# EAGLE design UnderWaterMetalDetector_v2 (EAGLE 6.5.0)

## Sheet 1 of 4
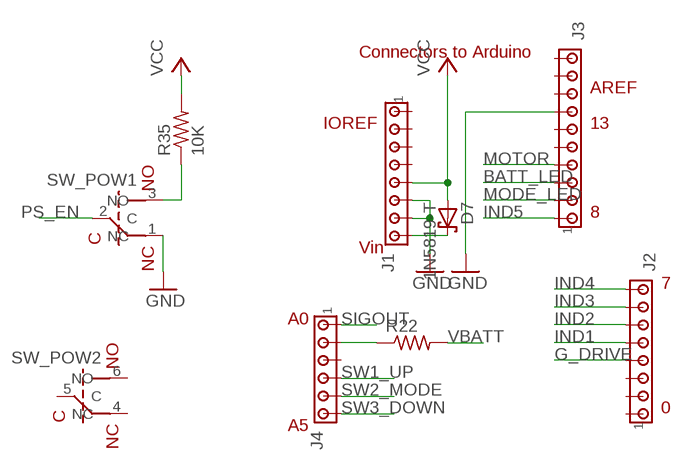
[diagram p0: schematic, sheet 1]

### Parts
D7  1N5819-T  [DO41-7.6]
J1  MTA08-100  [10X08MTA]
J2  MTA08-100  [10X08MTA]
J3  MTA10-100  [10X10MTA]
J4  MTA06-100  [10X06MTA]
R22  R-US_R1206  [R1206]
R35  10K  R-US_R1206  [R1206]
SW_POW  SW-TL2201EEYA  [SW-TL2201EEYA]

### Nets
BATT_LED: J3.3 ; also sheet 2
G_DRIVE: J2.4 ; also sheet 3
GND: J1.6 J1.7 J3.7 SW_POW.1(1:NC) ; also sheet 2,3,4
IND1: J2.5 ; also sheet 2
IND2: J2.6 ; also sheet 2
IND3: J2.7 ; also sheet 2
IND4: J2.8 ; also sheet 2
IND5: J3.1 ; also sheet 2
MODE_LED: J3.2 ; also sheet 2
MOTOR: J3.4 ; also sheet 2
N$14: J4.5 R22.1
N$15: D7.C J1.8
N$52: R35.1 SW_POW.3(1:NO)
PS_EN: SW_POW.2(1:C) ; also sheet 4
SIGOUT: J4.6 ; also sheet 3
SW1_UP: J4.3 ; also sheet 2
SW2_MODE: J4.2 ; also sheet 2
SW3_DOWN: J4.1 ; also sheet 2
VBATT: R22.2 ; also sheet 4
VCC: D7.A J1.5 R35.2 ; also sheet 2,3,4
Unconnected: J1.1 J1.2 J1.3 J1.4 J2.1 J2.2 J2.3 J3.5 J3.6 J3.8 J3.9 J3.10 J4.4 SW_POW.4(2:NC) SW_POW.5(2:C) SW_POW.6(2:NO)

### Notes on the sheet
- Connectors to Arduino
- AREF
- IOREF | 13
- 8
- Vin
- 7
- A0
- 0
- A5

## Sheet 2 of 4: User Interface
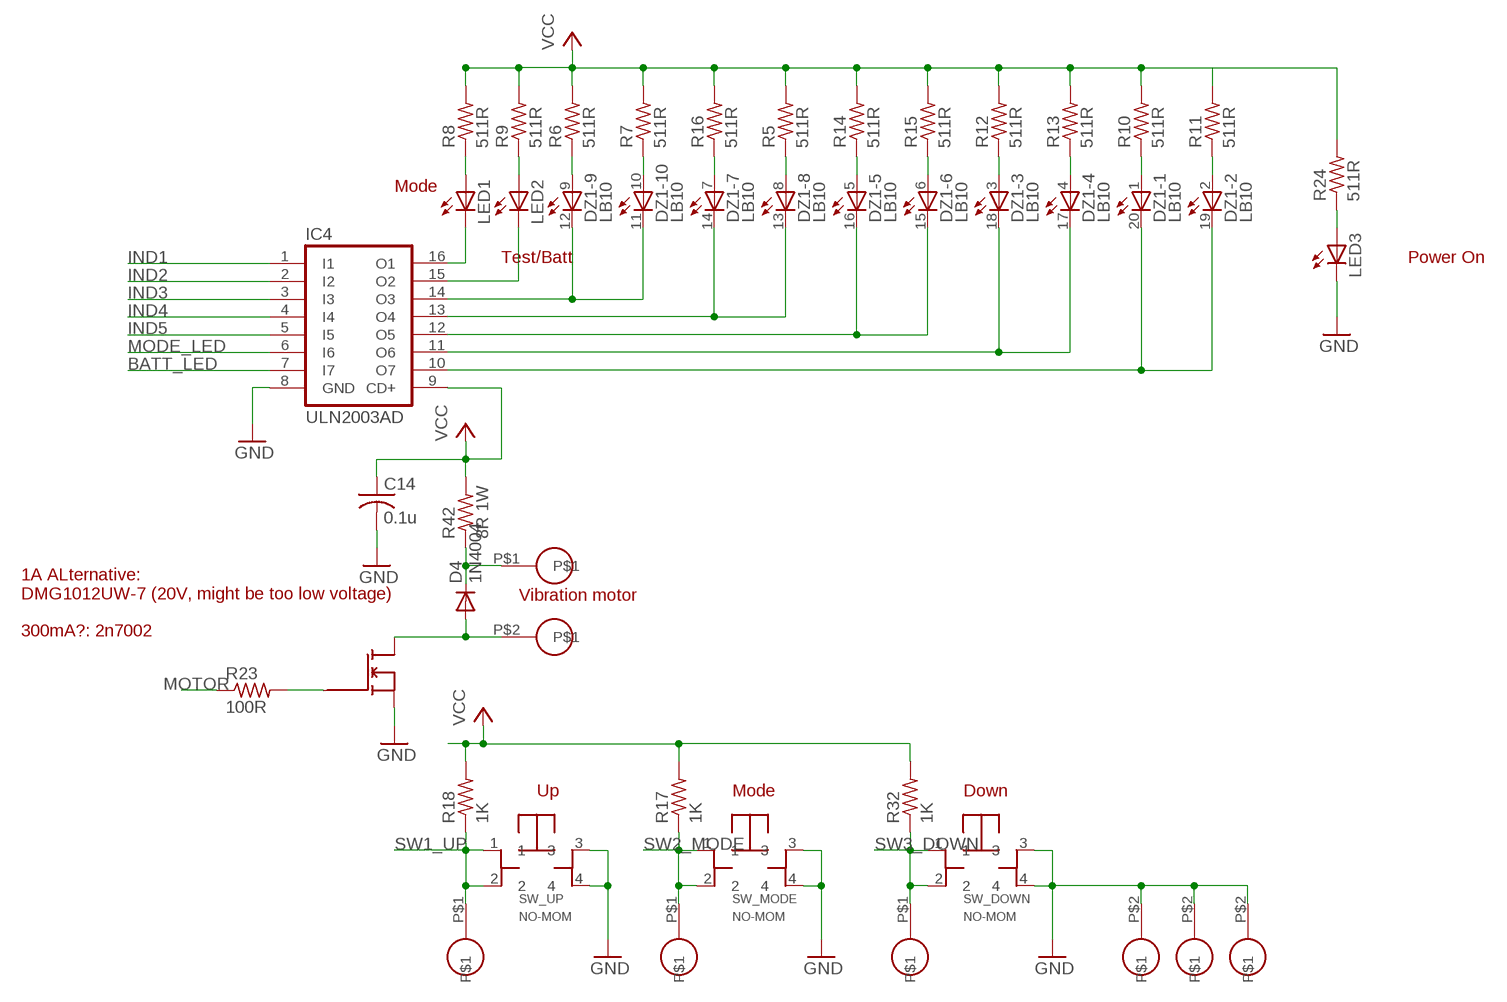
[diagram p1: schematic, sheet 2]

### Parts
C14  0.1u  C-USC1206  [C1206]
D4  1N4004  [DO41-10]
DOWN  CON-SIP2-0.1  [CON-SIP2-0.1]
DZ1  LB10  [LB10]
IC4  ULN2003AD  [SO16]
LED1  LED5MM  [LED5MM]
LED2  LED5MM  [LED5MM]
LED3  LED5MM  [LED5MM]
MODE  CON-SIP2-0.1  [CON-SIP2-0.1]
MOTOR  CON-SIP2-0.1  [CON-SIP2-0.1]
Q2  FET-2N7000  [TO92]
R5  511R  R-US_M1206  [M1206]
R6  511R  R-US_M1206  [M1206]
R7  511R  R-US_M1206  [M1206]
R8  511R  R-US_M1206  [M1206]
R9  511R  R-US_M1206  [M1206]
R10  511R  R-US_M1206  [M1206]
R11  511R  R-US_M1206  [M1206]
R12  511R  R-US_M1206  [M1206]
R13  511R  R-US_M1206  [M1206]
R14  511R  R-US_M1206  [M1206]
R15  511R  R-US_M1206  [M1206]
R16  511R  R-US_M1206  [M1206]
R17  1K  R-US_M1206  [M1206]
R18  1K  R-US_M1206  [M1206]
R23  100R  R-US_R1206  [R1206]
R24  511R  R-US_M1206  [M1206]
R32  1K  R-US_M1206  [M1206]
R42  8R 1W  R-US_R2512  [R2512]
SW_DOWN  SW-SCHURTER-1301.9306  [SW-SCHURTER-1301.9306]
SW_MODE  SW-SCHURTER-1301.9306  [SW-SCHURTER-1301.9306]
SW_UP  SW-SCHURTER-1301.9306  [SW-SCHURTER-1301.9306]
UP  CON-SIP2-0.1  [CON-SIP2-0.1]

### Nets
BATT_LED: IC4.7(I7) ; also sheet 1
GND: C14.2 DOWN.P$2 IC4.8(GND) LED3.K(C) MODE.P$2 Q2.1(S) SW_DOWN.3 SW_DOWN.4 SW_MODE.3 SW_MODE.4 SW_UP.3 SW_UP.4 UP.P$2 ; also sheet 1,3,4
IND1: IC4.1(I1) ; also sheet 1
IND2: IC4.2(I2) ; also sheet 1
IND3: IC4.3(I3) ; also sheet 1
IND4: IC4.4(I4) ; also sheet 1
IND5: IC4.5(I5) ; also sheet 1
MODE_LED: IC4.6(I6) ; also sheet 1
MOTOR: R23.1 ; also sheet 1
N$11 [Power]: D4.C MOTOR.P$1 R42.1
N$12: DZ1.17(-4:C) DZ1.18(-3:C) IC4.11(O6)
N$16: Q2.2(G) R23.2
N$17: LED3.A R24.1
N$20: DZ1.19(-2:C) DZ1.20(-1:C) IC4.10(O7)
N$22: DZ1.15(-6:C) DZ1.16(-5:C) IC4.12(O5)
N$23: DZ1.13(-8:C) DZ1.14(-7:C) IC4.13(O4)
N$24: DZ1.11(-10:C) DZ1.12(-9:C) IC4.14(O3)
N$25: IC4.16(O1) LED1.K(C)
N$26: IC4.15(O2) LED2.K(C)
N$32: LED2.A R9.1
N$33: LED1.A R8.1
N$34: DZ1.10(-10:A) R7.1
N$35: DZ1.9(-9:A) R6.1
N$36: DZ1.8(-8:A) R5.1
N$37: DZ1.1(-1:A) R10.1
N$38: DZ1.2(-2:A) R11.1
N$39: DZ1.3(-3:A) R12.1
N$40: DZ1.4(-4:A) R13.1
N$41: DZ1.5(-5:A) R14.1
N$42: DZ1.6(-6:A) R15.1
N$43: DZ1.7(-7:A) R16.1
N$46 [Power]: D4.A MOTOR.P$2 Q2.3(D)
SW1_UP: R18.1 SW_UP.1 SW_UP.2 UP.P$1 ; also sheet 1
SW2_MODE: MODE.P$1 R17.1 SW_MODE.1 SW_MODE.2 ; also sheet 1
SW3_DOWN: DOWN.P$1 R32.1 SW_DOWN.1 SW_DOWN.2 ; also sheet 1
VCC: C14.1 IC4.9(CD+) R5.2 R6.2 R7.2 R8.2 R9.2 R10.2 R11.2 R12.2 R13.2 R14.2 R15.2 R16.2 R17.2 R18.2 R24.2 R32.2 R42.2 ; also sheet 1,3,4

### Notes on the sheet
- Mode
- Test/Batt | Power On
- Vibration motor
- 1A ALternative:
  DMG1012UW-7 (20V, might be too low voltage)
  
  300mA?: 2n7002
- Up | Mode | Down

## Sheet 3 of 4
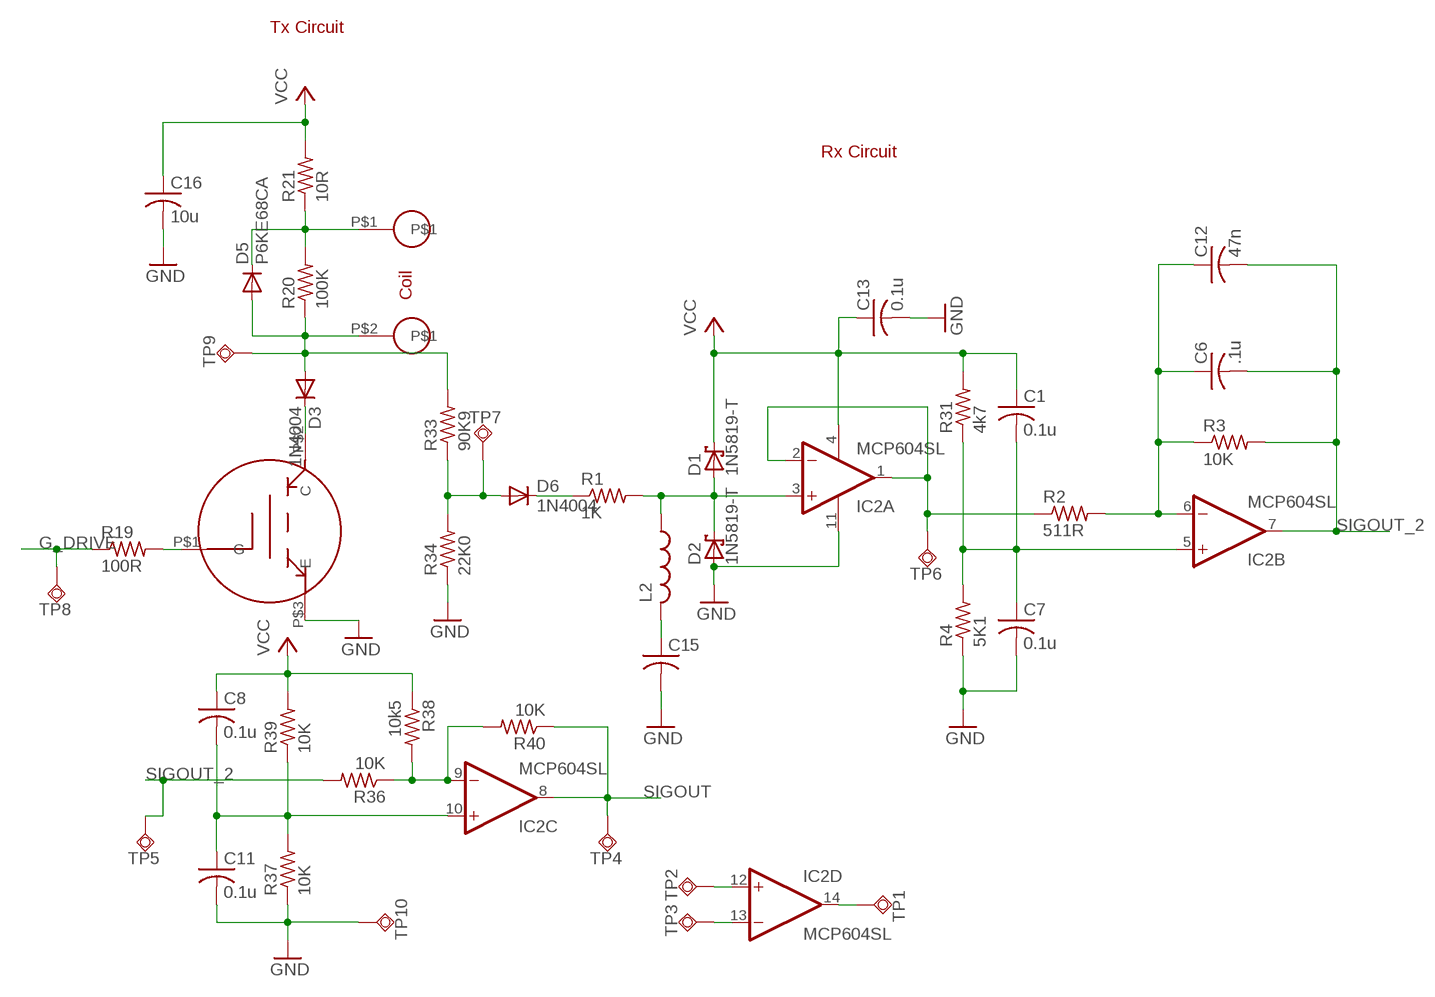
[diagram p2: schematic, sheet 3]

### Parts
C1  0.1u  C-USC1206  [C1206]
C6  .1u  C-USC1206  [C1206]
C7  0.1u  C-USC1206  [C1206]
C8  0.1u  C-USC1206  [C1206]
C11  0.1u  C-USC1206  [C1206]
C12  47n  C-USC1206  [C1206]
C13  0.1u  C-USC1206  [C1206]
C15  C-USC1206  [C1206]
C16  10u  C-USC1206  [C1206]
COIL  CON-SIP2-0.1  [CON-SIP2-0.1]
D1  1N5819-T  [DO41-7.6]
D2  1N5819-T  [DO41-7.6]
D3  1N4004  [DO41-10]
D5  P6KE68CA  DIODE-D-5  [D-5]
D6  1N4004  [DO41-10]
IC2  MCP604SL  [SO14]
L2  L-US0204V  [0204V]
Q1  STGP18N40LZ  [TO-220-HORIZ]
R1  1K  R-US_M1206  [M1206]
R2  511R  R-US_R1206  [R1206]
R3  10K  R-US_R1206  [R1206]
R4  5K1  R-US_R1206  [R1206]
R19  100R  R-US_R1206  [R1206]
R20  100K  R-US_M1206  [M1206]
R21  10R  R-US_R2512  [R2512]
R31  4k7  R-US_R1206  [R1206]
R33  90K9  R-US_M1206  [M1206]
R34  22K0  R-US_M1206  [M1206]
R36  10K  R-US_M1206  [M1206]
R37  10K  R-US_M1206  [M1206]
R38  10k5  R-US_M1206  [M1206]
R39  10K  R-US_M1206  [M1206]
R40  10K  R-US_M1206  [M1206]
TP1  TPSQPAD1-13  [P1-13]
TP2  TPSQPAD1-13  [P1-13]
TP3  TPSQPAD1-13  [P1-13]
TP4  TPSQPAD1-13  [P1-13]
TP5  TPSQPAD1-13  [P1-13]
TP6  TPSQPAD1-13  [P1-13]
TP7  TPSQPAD1-13  [P1-13]
TP8  TPSQPAD1-13  [P1-13]
TP9  TPSQPAD1-13  [P1-13]
TP10  TPSQPAD1-13  [P1-13]

### Nets
G_DRIVE: R19.1 TP8.TP ; also sheet 1
GND: C7.2 C11.2 C13.2 C15.2 C16.2 D2.A IC2.11(P:V-) Q1.P$3(E) R4.1 R34.1 R37.1 TP10.TP ; also sheet 1,2,4
N$1: IC2.1(A:OUT) IC2.2(A:-IN) R2.1 TP6.TP
N$2: D1.A D2.C IC2.3(A:+IN) L2.1 R1.2
N$3: D6.C R1.1
N$4: C1.2 C7.1 IC2.5(B:+IN) R4.2 R31.1
N$5: C8.2 C11.1 IC2.10(C:+IN) R37.2 R39.1
N$6: D6.A R33.1 R34.2 TP7.TP
N$7: C6.1 C12.1 IC2.6(B:-IN) R2.2 R3.1
N$8: IC2.9(C:-IN) R36.1 R38.2 R40.2
N$9: IC2.12(D:+IN) TP2.TP
N$10: IC2.13(D:-IN) TP3.TP
N$13: IC2.14(D:OUT) TP1.TP
N$27: C15.1 L2.2
N$44 [Power]: COIL.P$1 D5.C R20.2 R21.1
N$47 [Power]: D3.C Q1.P$2(C)
N$48: Q1.P$1(G) R19.2
RXIN [Power]: COIL.P$2 D3.A D5.A R20.1 R33.2 TP9.TP
SIGOUT: IC2.8(C:OUT) R40.1 TP4.TP ; also sheet 1
SIGOUT_2: C6.2 C12.2 IC2.7(B:OUT) R3.2 R36.2 TP5.TP
VCC: C1.1 C8.1 C13.1 C16.1 D1.C IC2.4(P:V+) R21.2 R31.2 R38.1 R39.2 ; also sheet 1,2,4

### Notes on the sheet
- Tx Circuit
- Rx Circuit
- Coil

## Sheet 4 of 4
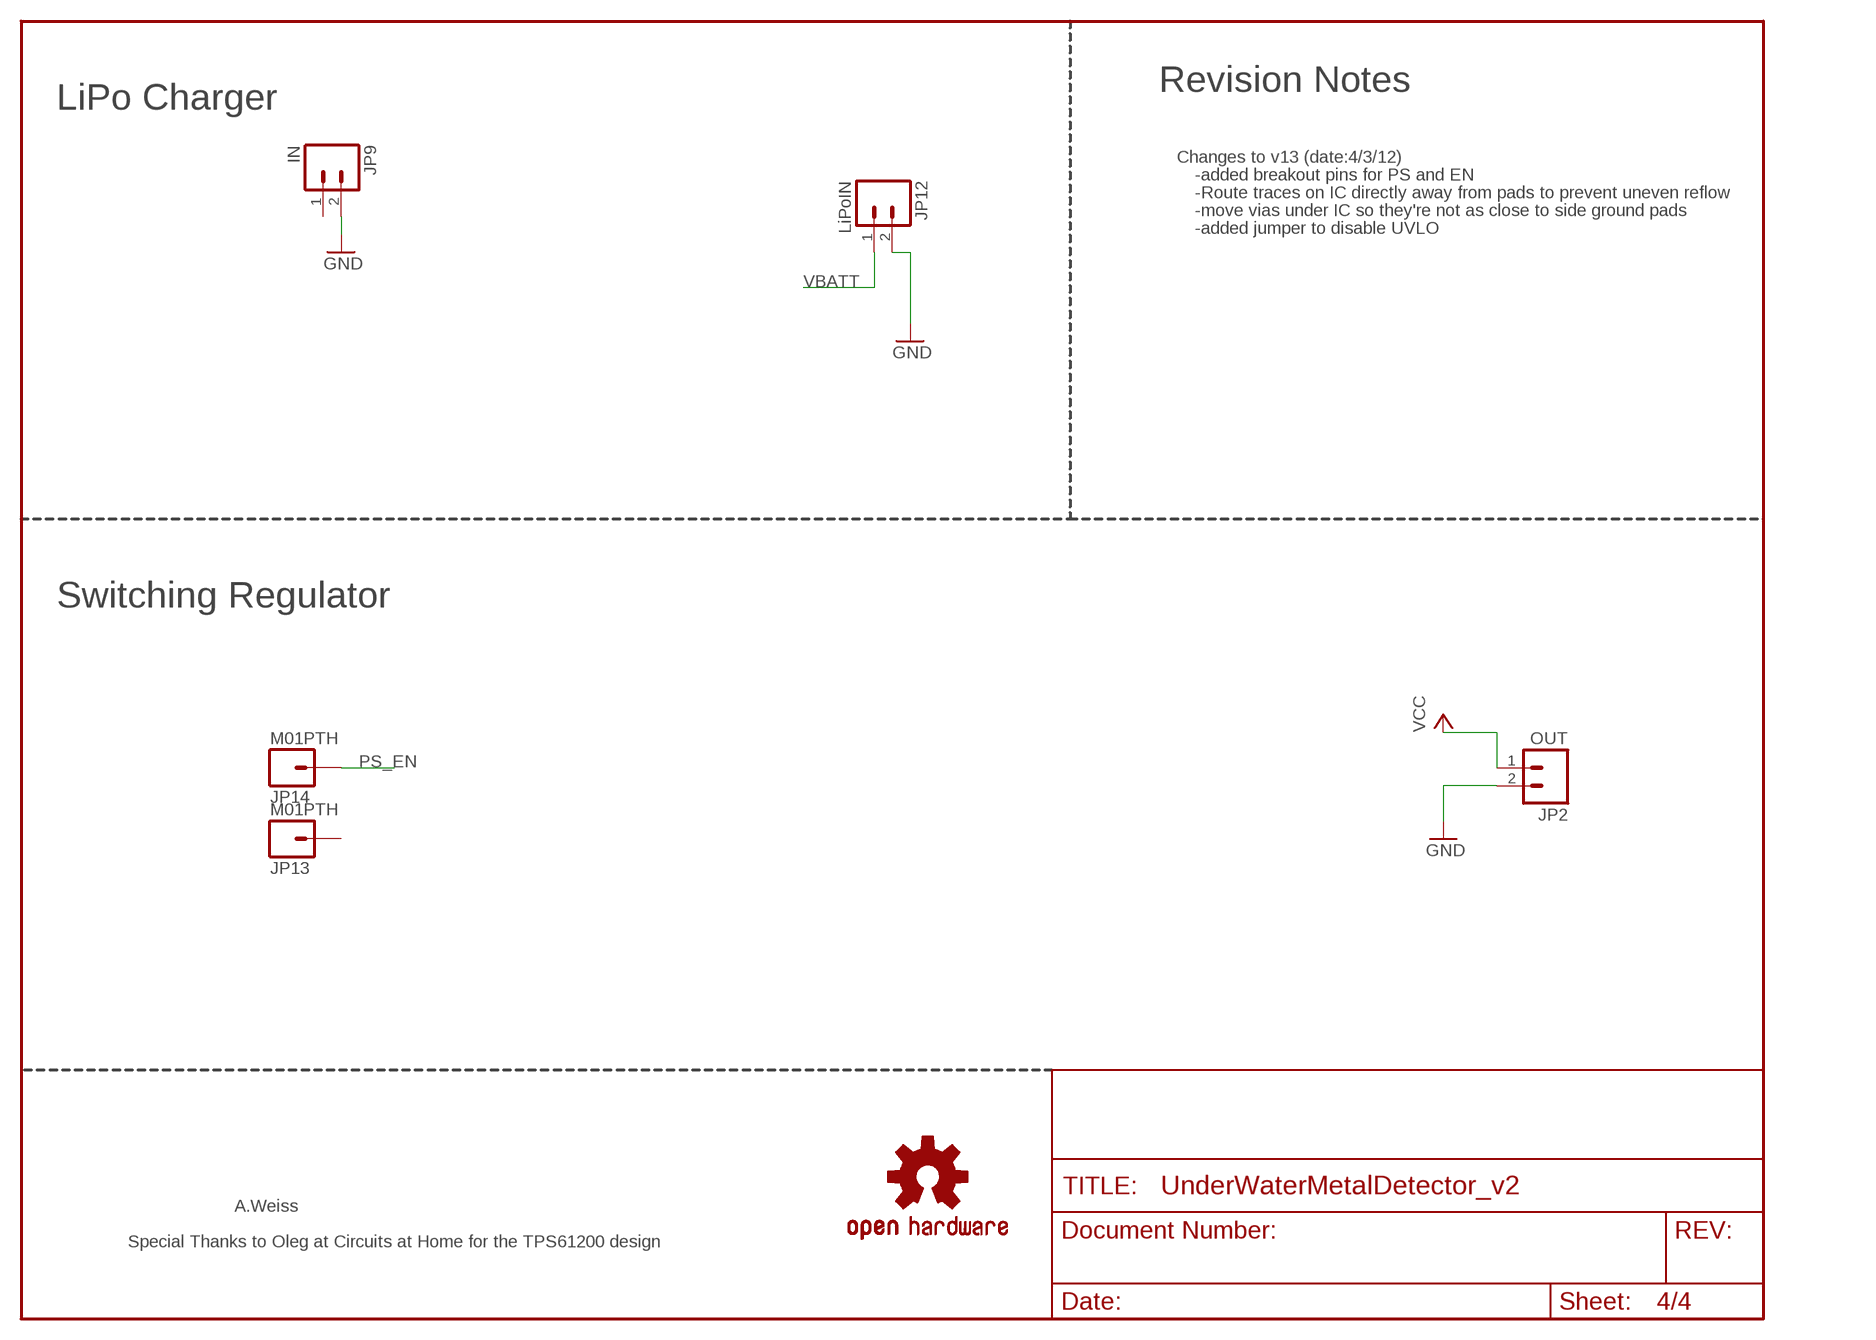
[diagram p3: schematic, sheet 4]

### Parts
JP2  OUT  M02PTH  [1X02]
JP9  IN  M02PTH  [1X02]
JP12  LiPoIN  M02PTH  [1X02]
JP13  M01PTH  [1X01]
JP14  M01PTH  [1X01]
U$3  OSHW-LOGOS  [OSHW-LOGO-S]

### Nets
GND: JP2.2 JP9.2 JP12.2 ; also sheet 1,2,3
PS_EN: JP14.1 ; also sheet 1
VBATT: JP12.1 ; also sheet 1
VCC: JP2.1 ; also sheet 1,2,3
Unconnected: JP9.1 JP13.1

### Notes on the sheet
- Revision Notes
- LiPo Charger
- Changes to v13 (date:4/3/12)
- -added breakout pins for PS and EN
- -Route traces on IC directly away from pads to prevent uneven reflow
- -move vias under IC so they're not as close to side ground pads
- -added jumper to disable UVLO
- Switching Regulator
- A.Weiss
- Special Thanks to Oleg at Circuits at Home for the TPS61200 design

## Library data of the parts
C1 C6-C8 C11-C16 = rcl:C-US: CAPACITOR, American symbol
COIL DOWN MODE MOTOR UP = PersonalLib-CRM:CON-SIP2-0.1
D1 D2 D7 = diode:1N581*: 1.0A SCHOTTKY BARRIER RECTIFIER Source: http://www.diodes.com/datasheets/ds23001.pdf
D3 D4 D6 = diode:1N4004: DIODE general purpose rectifier, 1 A
D5 = diode:DIODE-: DIODE
DZ1 = led:LB10: LED BLOCK 10-LED bar graph, DIL, Siemens
IC2 = linear:MCP604: Quad Op Amp 2.7V to 6.0V Single Supply CMOS Source: http://ww1.microchip.com/downloads/en/DeviceDoc/21314g.pdf
IC4 = uln-udn:ULN2003A: DRIVER ARRAY
J1 J2 = con-amp:MTA08-100: AMP connector
J3 = con-amp:MTA10-100: AMP connector
J4 = con-amp:MTA06-100: AMP connector
JP2 JP9 JP12 = SparkFun:M02: Header 2 Standard 2-pin 0.1" header. Use with straight break away headers (SKU : PRT-00116), right angle break away headers (PRT-00553), swiss pins (PRT-00743), machine pins (PRT-00117), and female headers (PRT-00115). Molex polarized connector foot print use with SKU : PRT-08233 with associated crimp pins and housings.
JP13 JP14 = SparkFun:M01: Header 1 Standard 1-pin 0.1" header. Use with straight break away headers (SKU : PRT-00116), right angle break away headers (PRT-00553), swiss pins (PRT-00743), machine pins (PRT-00117), and female headers (PRT-00115).
L2 = rcl:L-US: INDUCTOR, American symbol
LED1-LED3 = led:LED: LED OSRAM: - CHIPLED LG R971, LG N971, LY N971, LG Q971, LY Q971, LO R971, LY R971 LH N974, LH R974 LS Q976, LO Q976, LY Q976 LO Q996 - Hyper CHIPLED LW Q18S LB Q993, LB Q99A, LB R99A - SideLED LS A670, LO A670, LY A670, LG A670, LP A670 LB A673, LV A673, LT A673, LW A673 LH A674 LY A675 LS A676, LA A676, LO A676, LY A676, LW A676 LS A679, LY A679, LG A679 - Hyper Micro SIDELED® LS Y876, LA Y876, LO Y876, LY Y876 LT Y87S - SmartLED LW L88C, LW L88S LB L89C, LB L89S, LG L890 LS L89K, LO L89K, LY L89K LS L896, LA L896, LO L896, LY L896 - TOPLED LS T670, LO T670, LY T670, LG T670, LP T670 LSG T670, LSP T670, LSY T670, LOP T670, LYG T670 LG T671, LOG T671, LSG T671 LB T673, LV T673, LT T673, LW T673 LH T674 LS T676, LA T676, LO T676, LY T676, LB T676, LH T676, LSB T676, LW T676 LB T67C, LV T67C, LT T67C, LS T67K, LO T67K, LY T67K, LW E67C LS E67B, LA E67B, LO E67B, LY E67B, LB E67C, LV E67C, LT E67C LW T67C LS T679, LY T679, LG T679 LS T770, LO T770, LY T770, LG T770, LP T770 LB T773, LV T773, LT T773, LW T773 LH T774 LS E675, LA E675, LY E675, LS T675 LS T776, LA T776, LO T776, LY T776, LB T776 LHGB T686 LT T68C, LB T68C - Hyper Mini TOPLED® LB M676 - Mini TOPLED Santana® LG M470 LS M47K, LO M47K, LY M47K Source: http://www.osram.convergy.de LUXEON: - LUMILED® LXK2-PW12-R00, LXK2-PW12-S00, LXK2-PW14-U00, LXK2-PW14-V00 LXK2-PM12-R00, LXK2-PM12-S00, LXK2-PM14-U00 LXK2-PE12-Q00, LXK2-PE12-R00, LXK2-PE12-S00, LXK2-PE14-T00, LXK2-PE14-U00 LXK2-PB12-K00, LXK2-PB12-L00, LXK2-PB12-M00, LXK2-PB14-N00, LXK2-PB14-P00, LXK2-PB14-Q00 LXK2-PR12-L00, LXK2-PR12-M00, LXK2-PR14-Q00, LXK2-PR14-R00 LXK2-PD12-Q00, LXK2-PD12-R00, LXK2-PD12-S00 LXK2-PH12-R00, LXK2-PH12-S00 LXK2-PL12-P00, LXK2-PL12-Q00, LXK2-PL12-R00 Source: www.luxeon.com KINGBRIGHT: KA-3528ASYC Source: www.kingbright.com
Q1 = PersonalLib-CRM:STGP18N40LZ
Q2 = PersonalLib-CRM:FET-2N7000
R1-R24 R31-R40 R42 = rcl:R-US_: RESISTOR, American symbol
SW_DOWN SW_MODE SW_UP = ClickTracker:SW-SCHURTER-1301.9306
SW_POW = PersonalLib-CRM:SW-TL2201EEYA
TP1-TP10 = testpad:TPSQ: Test pad
U$3 = SparkFun:OSHW-LOGO: Open Source Hardware Logo This logo indicates the piece of hardware it is found on incorporates a OSHW license and/or adheres to the definition of open source hardware found here: http://freedomdefined.org/OSHW

## Net classes
0 default: width 0.254 mm
1 Power: width 0.635 mm

## Board
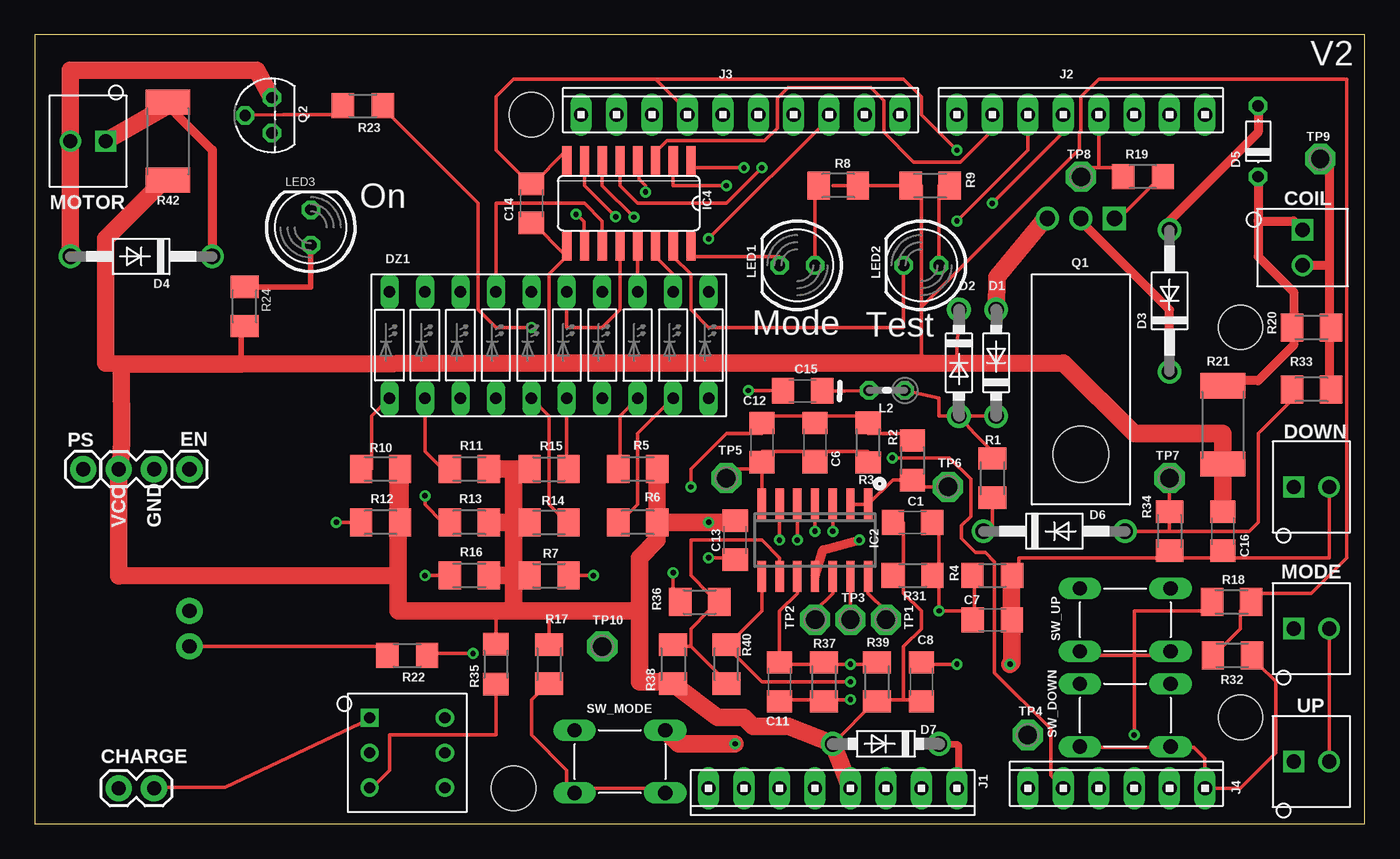
[diagram p4: board, top side]
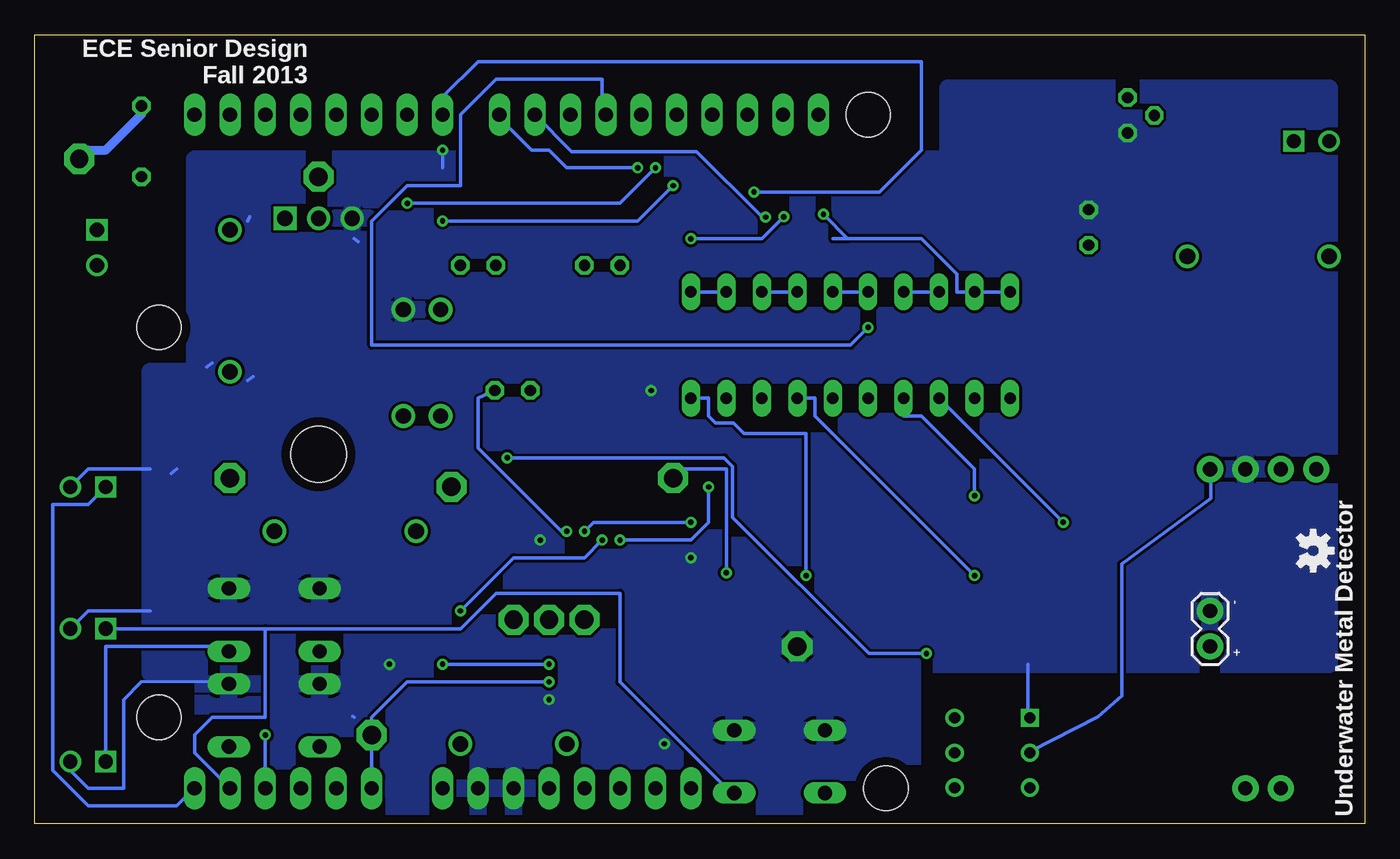
[diagram p5: board, bottom side, seen from below]

Size 95.25 x 56.52 mm. Coordinates in mm from the lower left corner, seen from the top.
Outline: 0,0 95.25,0 95.25,56.52 0,56.52 0,0
Copper layers (1*16): Top 0.035mm / dielectric 1.5mm / Bottom 0.035mm
Design rules "default": minimum track width 6mil, minimum drill 15mil, track to track 8mil, track to pad 8mil, pad to pad 8mil, via to via 8mil, smd to smd 8mil, copper to edge 25mil, drill to drill 8mil, minimum pad ring 10mil, minimum via ring 8mil, stop-mask expansion 4mil, vias tented up to drill 0mil, thermal gap 10mil
Holes 3.17 mm at 86.36,7.62 35.56,50.8 86.36,35.56 34.29,2.54

### Footprints (pad centres in the part's own frame; a part is rotated, then mirrored left to right if it is on the bottom)
C1206 = smd 1.6 x 1.8: 1 -1.4,0; 2 1.4,0
CON-SIP2-0.1 = drill 1.016 square: P$1 -1.27,0 | drill 1.016: P$2 1.27,0
DO41-7.6 = drill 1.1 pad 1.7: A 3.81,0; C -3.81,0
DO41-10 = drill 1.118: A 5.08,0; C -5.08,0
D-5 = drill 0.813 octagon: A 2.54,0; C -2.54,0
LB10 = drill 0.813 long: 1 -11.43,-3.81; 2 -8.89,-3.81; 3 -6.35,-3.81; 4 -3.81,-3.81; 5 -1.27,-3.81; 6 1.27,-3.81; 7 3.81,-3.81; 8 6.35,-3.81; 9 8.89,-3.81; 10 11.43,-3.81; 11 11.43,3.81; 12 8.89,3.81; 13 6.35,3.81; 14 3.81,3.81; 15 1.27,3.81; 16 -1.27,3.81; 17 -3.81,3.81; 18 -6.35,3.81; 19 -8.89,3.81; 20 -11.43,3.81
SO14 = smd 0.6 x 2.2: 1 -3.81,-2.6; 2 -2.54,-2.6; 3 -1.27,-2.6; 4 0,-2.6; 5 1.27,-2.6; 6 2.54,-2.6; 7 3.81,-2.6; 8 3.81,2.6; 9 2.54,2.6; 10 1.27,2.6; 11 0,2.6; 12 -1.27,2.6; 13 -2.54,2.6; 14 -3.81,2.6
SO16 = smd 0.66 x 2.032: 1 -4.445,-3.073; 2 -3.175,-3.073; 3 -1.905,-3.073; 4 -0.635,-3.073; 5 0.635,-3.073; 6 1.905,-3.073; 7 3.175,-3.073; 8 4.445,-3.073; 9 4.445,3.073; 10 3.175,3.073; 11 1.905,3.073; 12 0.635,3.073; 13 -0.635,3.073; 14 -1.905,3.073; 15 -3.175,3.073; 16 -4.445,3.073
10X08MTA = drill 1.016 long: 1 8.89,0; 2 6.35,0; 3 3.81,0; 4 1.27,0; 5 -1.27,0; 6 -3.81,0; 7 -6.35,0; 8 -8.89,0
10X10MTA = drill 1.016 long: 1 11.43,0; 2 8.89,0; 3 6.35,0; 4 3.81,0; 5 1.27,0; 6 -1.27,0; 7 -3.81,0; 8 -6.35,0; 9 -8.89,0; 10 -11.43,0
10X06MTA = drill 1.016 long: 1 6.35,0; 2 3.81,0; 3 1.27,0; 4 -1.27,0; 5 -3.81,0; 6 -6.35,0
1X02 = drill 1.016 pad 1.88: 1 0,0; 2 2.54,0
1X01 = drill 1.016 pad 1.88: 1 0,0
0204V = drill 0.813 octagon: 1 -1.27,0; 2 1.27,0
LED5MM = drill 0.813 octagon: A -1.27,0; K 1.27,0
TO-220-HORIZ = drill 1.1 square: P$1 4,-2.4 | drill 1.1: P$2 4,0; P$3 4,2.4 | hole 4: -12.9,0
TO92 = drill 0.813 octagon: 1 -1.27,0; 2 0,1.905; 3 1.27,0
M1206 = smd 1.6 x 2: 1 -1.4,0; 2 1.4,0
R1206 = smd 1.6 x 1.803: 1 -1.422,0; 2 1.422,0
R2512 = smd 1.8 x 3.2: 1 -2.8,0; 2 2.8,0
SW-SCHURTER-1301.9306 = drill 1.016 long: 1 -3.25,2.25; 2 3.25,2.25; 3 -3.25,-2.25; 4 3.25,-2.25
SW-TL2201EEYA = drill 0.8 square: 1 -2.5,-2.7 | drill 0.8: 2 0,-2.7; 3 2.5,-2.7; 4 2.5,2.7; 5 0,2.7; 6 -2.5,2.7
P1-13 = drill 1.321 pad 2.159 octagon: TP 0,0

### Placement (x,y rotation side)
C1  62.87,21.59 0 top
C6  55.88,27.3 270 top
C7  68.58,14.61 0 top
C8  63.5,10.16 90 top
C11  53.34,10.16 270 top
C12  52.07,27.3 270 top
C13  50.16,20.32 270 top
C14  35.56,44.45 90 top
C15  54.99,31.01 180 top
C16  85.09,20.95 270 top
COIL  90.81,41.27 270 top
D1  66.19,33.02 270 top
D2  68.86,33.02 90 top
D3  81.28,37.47 90 top
D4  7.62,40.64 180 top
D5  87.63,48.9 90 top
D6  73.03,20.95 0 top
D7  60.96,5.71 180 top
DOWN  91.44,24.13 0 top
DZ1  36.83,34.29 0 top
IC2  55.88,20.32 180 top
IC4  42.55,44.45 180 top
J1  57.15,2.54 180 top
J2  74.93,50.8 0 top
J3  50.55,50.8 0 top
J4  77.47,2.54 0 top
JP2  5.99,25.4 0 top
JP9  5.99,2.54 0 top
JP12  11.07,12.7 90 bottom
JP13  3.45,25.4 0 top
JP14  11.07,25.4 0 top
L2  61.04,31.04 180 top
LED1  54.61,40.01 180 top
LED2  63.5,40.01 180 top
LED3  19.76,42.72 90 top
MODE  91.44,13.97 0 top
MOTOR  3.81,48.9 180 top
Q1  74.93,39.37 90 top
Q2  16.97,50.75 90 top
R1  68.58,24.77 90 top
R2  62.87,26.04 90 top
R3  59.69,27.3 270 top
R4  68.58,17.78 180 top
R5  43.18,25.4 0 top
R6  43.18,21.59 0 top
R7  36.83,17.78 180 top
R8  57.56,45.72 0 top
R9  64.14,45.72 180 top
R10  24.77,25.4 0 top
R11  31.11,25.4 0 top
R12  24.77,21.59 0 top
R13  31.11,21.59 0 top
R14  36.83,21.59 180 top
R15  36.83,25.4 180 top
R16  31.11,17.78 0 top
R17  36.83,11.43 90 top
R18  85.72,15.88 0 top
R19  79.38,46.35 0 top
R20  91.44,35.56 180 top
R21  85.09,28.57 270 top
R22  26.67,12.06 180 top
R23  23.5,51.44 180 top
R24  15.01,37.06 270 top
R31  62.87,17.78 180 top
R32  85.78,12.06 180 top
R33  91.44,31.11 0 top
R34  81.28,20.95 90 top
R35  33.02,11.43 90 top
R36  47.62,15.88 180 top
R37  56.52,10.16 90 top
R38  45.72,11.43 90 top
R39  60.33,10.16 270 top
R40  49.53,11.43 270 top
R42  9.53,48.9 270 top
SW_DOWN  78.11,7.77 180 top
SW_MODE  41.91,4.45 180 top
SW_POW  26.67,5.08 270 top
SW_UP  78.11,14.61 180 top
TP1  60.96,14.61 270 top
TP2  55.88,14.61 90 top
TP3  58.42,14.61 180 top
TP4  71.12,6.35 180 top
TP5  49.53,24.77 90 top
TP6  65.41,24.13 0 top
TP7  81.28,24.77 0 top
TP8  74.93,46.35 0 top
TP9  92.08,47.62 0 top
TP10  40.64,12.7 180 top
U$3  3.68,19.56 270 bottom
UP  91.44,4.45 0 top

### Tracks (layer width: path | path; a pad name or v marks a point on that pad's centre or on a via)
BATT_LED  (via drill 0.38)
  Top 0.254: IC4.7 39.37,45.72 v41.6,43.48 | v48.26,41.91 57.15,50.8 J3.3
  Bottom 0.254: v41.6,43.48 43.18,41.91 v48.26,41.91
G_DRIVE
  Top 0.254: 76.2,46.99 74.93,46.99 TP8.TP | 76.2,46.99 77.47,46.99 R19.1 | 76.2,46.99 J2.4
GND  (via drill 0.38)
  Top 0.254: 81.28,19.05 85.09,19.05 | 81.28,19.05 70.48,19.05 70.48,18.41 R4.1 69.95,17.7 | 81.28,19.05 R34.1 | MODE.P$2 UP.P$2 | C11.2 53.34,8.89 55.88,8.89 R37.1 57.15,8.89 v58.42,8.89 | v48.26,19.05 49.53,19.05 C13.2 | v51.1,31.04 53.72,31.04 C15.2 | 85.09,19.05 92.71,19.05 DOWN.P$2 | 85.09,19.05 C16.2 | 35.56,45.72 38.1,48.26 IC4.8 | 44.45,53.34 46.99,50.8 J3.7 | 44.45,53.34 34.29,53.34 33.02,52.07 33.02,48.26 35.56,45.72 | 35.56,45.72 C14.2 | v66.04,48.26 63.5,50.8 63.5,52.07 62.23,53.34 44.45,53.34 | SW_MODE.3 45.26,6.71 45.19,6.63 | JP9.2 8.59,2.59 13.61,2.59 23.93,7.47 SW_POW.1
  Top 0.635: IC2.11 56.45,19.62 v59.05,20.32
  Top 1.27: 69.95,17.7 69.95,15.3 69.98,15.22 C7.2 69.98,11.56 v69.85,11.43 | D2.A 68.91,39.17 72.49,43.51 Q1.P$3 | v50.16,5.71 46.1,5.71 45.19,6.63 45.14,6.68
  Bottom 0.254: 24.13,11.43 24.13,7.62 SW_POW.1 | DOWN.P$2 91.44,25.4 87,25.4 | MODE.P$2 91.44,15.24 87,15.24 | 82.55,33.02 82.96,32.72 | 80.01,31.75 79.6,32.05 | 85.09,25.4 85.49,25.09 | 72.39,7.62 72.48,7.71 | 72.39,41.91 72.08,41.72 | 80.01,43.18 79.86,43.49 | SW_DOWN.3 81.71,10.19 87.63,10.16 88.9,8.89 88.9,2.54 91.44,2.54 92.71,3.81 UP.P$2 | v66.04,48.26 66.04,46.99
  pour Bottom: 32.38,0.64 83.19,0.64 83.19,10.79 87,10.79 87,32.38 83.82,32.38 83.82,47.62 29.84,47.62 29.84,52.7 2.54,52.7 2.54,11.43 32.38,11.43
IND1  (via drill 0.38)
  Top 0.254: v50.8,46.99 46.99,46.99 IC4.1 | v68.58,44.45 73.66,49.53 J2.5
  Bottom 0.254: v50.8,46.99 53.34,44.45 v68.58,44.45
IND2  (via drill 0.38)
  Top 0.254: IC4.2 45.72,45.72 v49.53,45.72 | v66.04,43.18 71.12,48.26 J2.6
  Bottom 0.254: v49.53,45.72 52.07,43.18 v66.04,43.18
IND3
  Top 0.254: J2.7 68.58,49.68 66.29,47.4 62.94,47.4 60.81,49.53 60.81,51.82 59.89,52.73 53.95,52.73 53.19,51.97 53.19,49.84 52.27,48.92 45.26,48.92 44.5,48.16 44.5,47.55 IC4.3
IND4  (via drill 0.38)
  Top 0.254: IC4.4 43.28,47.4 43.28,46.18 43.74,45.72 v43.74,45.26
  Bottom 0.254: J2.8 66.04,52.07 63.5,54.61 31.75,54.61 31.75,48.26 34.75,45.26 v43.74,45.26
IND5  (via drill 0.38)
  Top 0.254: IC4.5 41.91,45.72 43.18,44.45 49.53,44.45 v52.07,46.99
  Bottom 0.254: v52.07,46.99 57.15,46.99 58.42,48.26 59.69,48.26 62.23,50.8 J3.1
MODE_LED  (via drill 0.38)
  Top 0.254: IC4.6 40.64,45.72 v42.9,43.46
  Bottom 0.254: J3.2 56.79,48.16 47.85,48.16 43.28,43.59 42.98,43.59 v42.9,43.46
MOTOR  (via drill 0.38)
  Top 0.254: v35.56,35.56 33.02,35.56 31.75,36.83 31.75,44.45 25.45,50.75 R23.1 25.4,50.8
  Bottom 0.254: v35.56,35.56 36.83,34.29 71.12,34.29 71.12,43.18 68.58,45.72 64.77,45.72 64.77,50.8 62.23,53.34 54.61,53.34 54.61,50.8 J3.4
N$1
  Top 0.254: 59.69,22.86 58.42,22.86 IC2.2 | TP6.TP 63.5,24.13 R2.1 61.47,24.64 59.69,22.86 | 59.69,22.86 IC2.1
N$2  (via drill 0.38)
  Top 0.254: D1.A 67.31,27.94 68.58,26.67 R1.2 | D1.A D2.C | v57.15,20.95 IC2.3 | D1.A 64.77,29.21 64.77,30.48 L2.1
  Bottom 0.254: L2.1 63.5,30.48 63.5,26.92 57.53,20.95 v57.15,20.95
N$3
  Top 0.254: D6.C 68.58,20.95 R1.1
N$4  (via drill 0.38)
  Top 0.254: 67.31,15.24 67.31,17.78 R4.2 | 64.77,17.78 64.77,21.59 C1.2 | v54.61,20.32 IC2.5 | 64.77,17.78 v64.77,15.24 67.31,15.24 | 64.77,17.78 R31.1 | 67.31,15.24 C7.1
  Bottom 0.254: v54.61,20.32 55.88,19.05 60.96,19.05 v64.77,15.24
N$5  (via drill 0.38)
  Top 0.254: v66.04,11.43 63.5,11.43 C8.2 | R39.1 59.69,11.43 v58.42,11.43 57.15,11.43 R37.2 55.88,11.43 53.34,11.43 C11.1 53.34,15.24 54.61,16.51 IC2.10 54.61,17.78
  Bottom 0.254: v58.42,11.43 v66.04,11.43
N$6
  Top 0.254: TP7.TP R34.2 81.28,20.95 | 81.28,20.95 87,20.95 87.63,21.59 87.63,27.94 90.17,30.48 R33.1 | D6.A 81.28,20.95
N$7  (via drill 0.38)
  Top 0.254: R2.2 62.23,27.94 59.69,27.94 R3.1 59.69,29.21 55.88,29.21 | 55.88,29.21 52.07,29.21 C12.1 52.07,27.94 49.53,27.94 46.99,25.4 v46.99,24.13 | v53.34,20.32 IC2.6 | 55.88,29.21 C6.1
  Bottom 0.254: v53.34,20.32 48.26,20.32 46.99,21.59 v46.99,24.13
N$8
  Top 0.254: 46.99,12.7 49.53,10.16 R40.2 | 46.99,12.7 45.72,12.7 R38.2 | 46.99,12.7 46.99,13.97 48.26,15.24 R36.1 48.26,16.51 46.99,17.78 46.99,20.32 52.07,20.32 53.34,19.05 IC2.9
N$9
  Top 0.254: 57.15,17.78 IC2.12 57.15,16.51 55.88,15.24 TP2.TP
N$10
  Top 0.254: TP3.TP IC2.13 58.42,17.78
N$11
  Top 0.635: D4.C 12.7,48.26 10.16,50.8 R42.1
  Top 1.27: MOTOR.P$1 9.53,51.44 R42.1
N$12
  Top 0.254: IC4.11 40.64,43.18 39.37,44.45 33.02,44.45 DZ1.17
  Bottom 0.254: DZ1.17 DZ1.18
N$13
  Top 0.254: 59.69,17.78 IC2.14 59.69,16.51 60.96,15.24 TP1.TP
N$14  (via drill 0.38)
  Top 0.254: v31.39,12.19 28.19,12.19 R22.1 | v61.42,26.21 65.51,26.21 67.03,24.69 67.03,22.02 66.37,21.36 66.37,20.42 67.36,19.43 68.07,19.43 68.73,18.77 68.73,10.82 72.77,6.78 72.77,3.45 J4.5
  Bottom 0.254: v31.39,12.19 35.51,12.19 45.26,21.95 45.26,25.6 45.87,26.21 v61.42,26.21
N$15
  Top 0.508: J1.8 66.14,2.59 66.14,5.64 D7.C
N$16
  Top 0.254: Q2.2 17.78,50.8 21.59,50.8 R23.2
N$17
  Top 0.406: R24.1 19.76,38.46 LED3.A
N$20  (via drill 0.38)
  Top 0.254: IC4.10 39.32,41.45 39.32,43.13 38.86,43.59 v38.76,43.66
  Bottom 0.254: 37.03,41.91 31.75,41.91 29.21,39.37 29.21,38.1 DZ1.19 DZ1.20 | 37.03,41.91 38.1,41.91 | 37.03,41.91 38.71,43.59 v38.76,43.66
N$22
  Top 0.254: IC4.12 41.91,36.83 40.64,35.56 38.1,35.56 DZ1.15
  Bottom 0.254: DZ1.15 DZ1.16
N$23
  Top 0.254: DZ1.13 IC4.13
  Bottom 0.254: DZ1.13 DZ1.14
N$24
  Top 0.254: DZ1.12 45.72,39.37 44.45,40.64 IC4.14
  Bottom 0.254: DZ1.12 DZ1.11
N$25
  Top 0.254: IC4.16 46.99,40.64 53.34,40.64 LED1.K
N$26
  Top 0.254: LED2.K 62.23,35.56 48.26,35.56 46.99,36.83 46.99,39.37 45.72,40.64 IC4.15
N$27
  Top 0.254: L2.2 58.04,30.99 C15.1
N$32
  Top 0.254: LED2.A 64.77,45.72 R9.1
N$33
  Top 0.254: LED1.A 55.88,44.45 55.83,45.82 R8.1
N$34  (via drill 0.38)
  Top 0.254: v40.01,17.78 R7.1 38.1,17.78
  Bottom 0.254: v40.01,17.78 40.01,27.94 44.45,27.94 45.21,28.7 46.48,28.7 46.99,29.21 46.99,30.48 DZ1.10
N$35
  Top 0.254: DZ1.9 43.18,27.94 43.18,22.86 41.91,21.59 R6.1
N$36
  Top 0.254: DZ1.8 41.91,29.21 41.91,25.4 R5.1
N$37
  Top 0.254: DZ1.1 24.13,29.21 24.13,25.4 R10.1
N$38
  Top 0.254: DZ1.2 27.94,26.67 29.21,25.4 R11.1
N$39  (via drill 0.38)
  Top 0.254: v21.59,21.59 R12.1
  Bottom 0.254: DZ1.3 v21.59,21.59
N$40  (via drill 0.38)
  Top 0.254: v27.94,23.5 27.94,22.86 29.21,21.59 R13.1
  Bottom 0.254: v27.94,23.5 27.94,25.4 31.75,29.21 33.02,29.21 DZ1.4
N$41
  Top 0.254: DZ1.5 36.83,29.21 36.83,22.86 38.1,21.59 R14.1
N$42
  Top 0.254: DZ1.6 38.1,25.4 R15.1
N$43  (via drill 0.38)
  Top 0.254: v27.94,17.78 R16.1
  Bottom 0.254: v27.94,17.78 39.37,29.21 39.37,30.48 DZ1.7
N$44
  Top 0.635: 90.17,35.56 90.17,38.1 87.63,40.64 87.63,43.18 | D5.C 87.63,43.18 | 87.63,43.18 90.17,43.18 COIL.P$1 | 90.17,35.56 90.17,34.29 87.63,31.75 85.09,31.75 R21.1 | 90.17,35.56 R20.2
N$46
  Top 1.27: D4.A MOTOR.P$2 2.54,53.98 15.88,53.98 Q2.3
N$47
  Top 0.635: D3.C 81.28,36.83 74.93,43.18 Q1.P$2
N$48
  Top 0.254: R19.2 80.01,45.72 77.67,43.38 Q1.P$1
N$52
  Top 0.254: R35.1 33.02,6.35 25.4,6.35 25.4,3.81 24.13,2.54 SW_POW.3
PS_EN
  Bottom 0.254: 24.13,5.08 SW_POW.2 23.93,5.18 19.1,7.67 17.4,9.14 17.4,18.59 11.02,23.32 11.02,25.3 JP14.1
RXIN
  Top 0.635: D5.A 87.63,49.53 81.28,43.18 D3.A | 92.71,40.01 92.71,46.99 TP9.TP | 92.71,40.01 92.71,35.56 | 92.71,35.56 92.71,31.75 R33.2 | COIL.P$2 92.71,40.01 | 92.71,35.56 R20.1
  Bottom 0.635: TP9.TP 91.44,48.26 90.17,48.26 87.63,50.8 D5.A
SIGOUT  (via drill 0.38)
  Top 0.254: 49.53,12.7 52.07,15.24 IC2.8 52.07,17.78 | 49.53,12.7 52.07,10.16 v58.42,10.16 | 49.53,12.7 R40.1
  Bottom 0.254: v58.42,10.16 68.58,10.16 71.12,7.62 TP4.TP J4.6 71.12,1.91
SIGOUT_2  (via drill 0.38)
  Top 0.254: 52.07,25.4 49.53,25.4 TP5.TP | 55.88,26.67 52.07,26.67 C12.2 52.07,25.4 | 55.88,26.67 59.69,26.67 R3.2 | 55.88,26.67 C6.2 | v45.72,17.98 45.72,16.51 R36.2 | 52.07,25.4 IC2.7 52.07,22.86
  Bottom 0.254: v45.72,17.98 45.72,25.4 49.53,25.4 TP5.TP
SW1_UP  (via drill 0.38)
  Top 0.254: 78.74,12.06 78.74,15.24 83.82,15.24 R18.1 | 78.74,12.06 81.28,12.06 SW_UP.1 | 78.74,12.06 v78.74,6.35 | 78.74,12.06 74.93,12.06 SW_UP.2
  Bottom 0.254: v78.74,6.35 J4.3 | UP.P$1 90.17,12.7 82.55,12.7 SW_UP.1
SW2_MODE
  Top 0.254: R17.1 36.83,10.16 35.56,8.89 35.56,6.35 38.1,3.81 38.1,2.54 SW_MODE.2 39.37,2.54 44.45,2.54 SW_MODE.1
  Bottom 0.254: 78.74,13.97 78.74,7.62 82.55,7.62 83.82,6.35 83.82,5.08 J4.2 | MODE.P$1 78.74,13.97 | 78.74,13.97 64.77,13.97 62.23,16.51 53.34,16.51 53.34,10.16 45.72,2.54 SW_MODE.1
SW3_DOWN
  Top 0.254: R32.1 87.63,11.43 88.9,10.19 88.9,5.08 86.36,2.54 J4.1 83.82,4.7 83.03,5.49 81.33,5.49 | 81.33,5.49 74.85,5.49 SW_DOWN.2 | 81.33,5.49 81.33,5.5 SW_DOWN.1
  Bottom 0.254: J4.1 85.09,1.27 91.44,1.27 93.98,3.81 93.98,22.86 91.44,22.86 DOWN.P$1
VBATT
  Top 0.254: JP12.1 25.4,12.7 R22.2
VCC  (via drill 0.38)
  Top 0.254: 57.15,45.72 R8.2 R9.2 63.5,45.72 63.5,37.03 | 38.1,40.64 35.56,43.18 C14.1 | 62.23,17.78 62.23,21.59 C1.1 | 62.23,8.89 60.96,8.89 R39.2 60.22,8.79 D7.A | 62.23,8.89 63.5,8.89 C8.1 | 35.56,15.24 33.02,15.24 R35.2 | R12.2 26.67,21.59 26.67,25.4 R10.2 | v55.88,20.95 IC2.4 | 62.23,17.78 62.23,16.51 63.5,15.24 63.5,13.97 62.23,12.7 62.23,8.89 | 62.23,17.78 R31.2 | 38.1,40.64 36.83,39.37 36.83,33.02 | 38.1,40.64 IC4.9 | 66.02,32.97 D1.C | 63.5,33.02 63.5,36.88 | 63.5,36.88 63.5,37.03 | 36.83,15.24 R17.2 36.83,12.7 | R32.2 85.09,12.7 86.36,13.97 86.36,15.24 R18.2 87.63,16.51 91.44,16.51 93.98,19.05 93.98,53.34 76.2,53.34 74.93,52.07 74.93,49.53 74.83,49.53 74.83,48.31 63.55,37.03 63.5,37.03 | 63.55,36.88 63.5,36.88 | 6.15,25.91 JP2.1
  Top 0.406: R24.2 14.79,35.66 14.79,32.95
  Top 1.27: 6.17,32.92 6.22,27.41 6.15,25.91 | 6.17,32.92 14.79,32.95 36.83,33.02 63.5,33.02 66.02,32.97 73.66,33.02 78.74,27.94 85.09,27.94 R21.2 C16.1 | 6.17,32.92 5.08,33.02 5.08,41.91 9.53,46.35 R42.2 | JP2.1 5.99,17.75 26.04,17.78 | 26.04,17.78 26.04,15.24 33.02,15.24 34.29,15.24 | 34.29,15.24 35.56,15.24 36.83,15.24 43.31,15.24 | 43.31,15.24 43.31,10.16 45.72,10.16 R38.1 48.9,7.62 50.8,7.62 51.44,6.99 53.98,6.99 D7.A J1.5 | 43.31,15.24 43.31,18.97 43.31,19.05 44.58,20.32 R6.2 | R6.2 v48.26,21.59 50.16,21.59 C13.1 | R6.2 R5.2 | R16.2 R7.2 34.29,17.78 | R13.2 34.29,21.59 | 34.29,21.59 R14.2 | R11.2 R15.2 34.29,25.4 34.29,21.59 | 34.29,17.78 34.29,15.24 | 34.29,21.59 34.29,17.78 | R10.2 26.04,25.4 26.04,17.78
  Bottom 0.254: v55.88,20.95 55.24,21.59 v48.26,21.59

### Text on the board
tPlace: V2 | On | Mode | Test | PS | EN | VCC | GND | CHARGE
bPlace: ECE Senior Design / Fall 2013 | - | + | Underwater Metal Detector